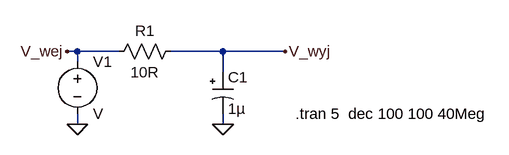
[diagram p0: schematic Draft2.asc]
Draft2.asc, the LTspice schematic file:
Version 4
SHEET 1 880 680
WIRE -48 128 -64 128
WIRE 16 128 -48 128
WIRE 176 128 96 128
WIRE 272 128 176 128
WIRE -48 144 -48 128
WIRE 176 160 176 128
WIRE -48 240 -48 224
WIRE 176 240 176 224
FLAG 176 240 0
FLAG 272 128 V_wyj
FLAG -64 128 V_wej
FLAG -48 240 0
SYMBOL res 112 112 R90
WINDOW 0 0 56 VBottom 2
WINDOW 3 32 56 VTop 2
SYMATTR InstName R1
SYMATTR Value 10R
SYMBOL polcap 160 160 R0
WINDOW 3 24 56 Left 2
SYMATTR InstName C1
SYMATTR Value 1µ
SYMATTR Description Capacitor
SYMATTR Type cap
SYMATTR SpiceLine V=16 Irms=0 Rser=11 Lser=0 mfg="AVX" pn="TAJA105K016" type="Tantalum"
SYMBOL voltage -48 128 R0
SYMATTR InstName V1
TEXT 288 224 Left 2 !.tran 5  dec 100 100 40Meg

The netlist it stands for:
* Draft2.asc
R1 V_wyj V_wej 10R
C1 V_wyj 0 1µ V=16 Irms=0 Rser=11 Lser=0 mfg="AVX" pn="TAJA105K016" type="Tantalum"
V1 V_wej 0 V
.tran 5  dec 100 100 40Meg
.backanno
.end